# Altium schematic sheet bmsSlave_cells.SchDoc
size B; SheetNumber: 3; SheetTotal: 4
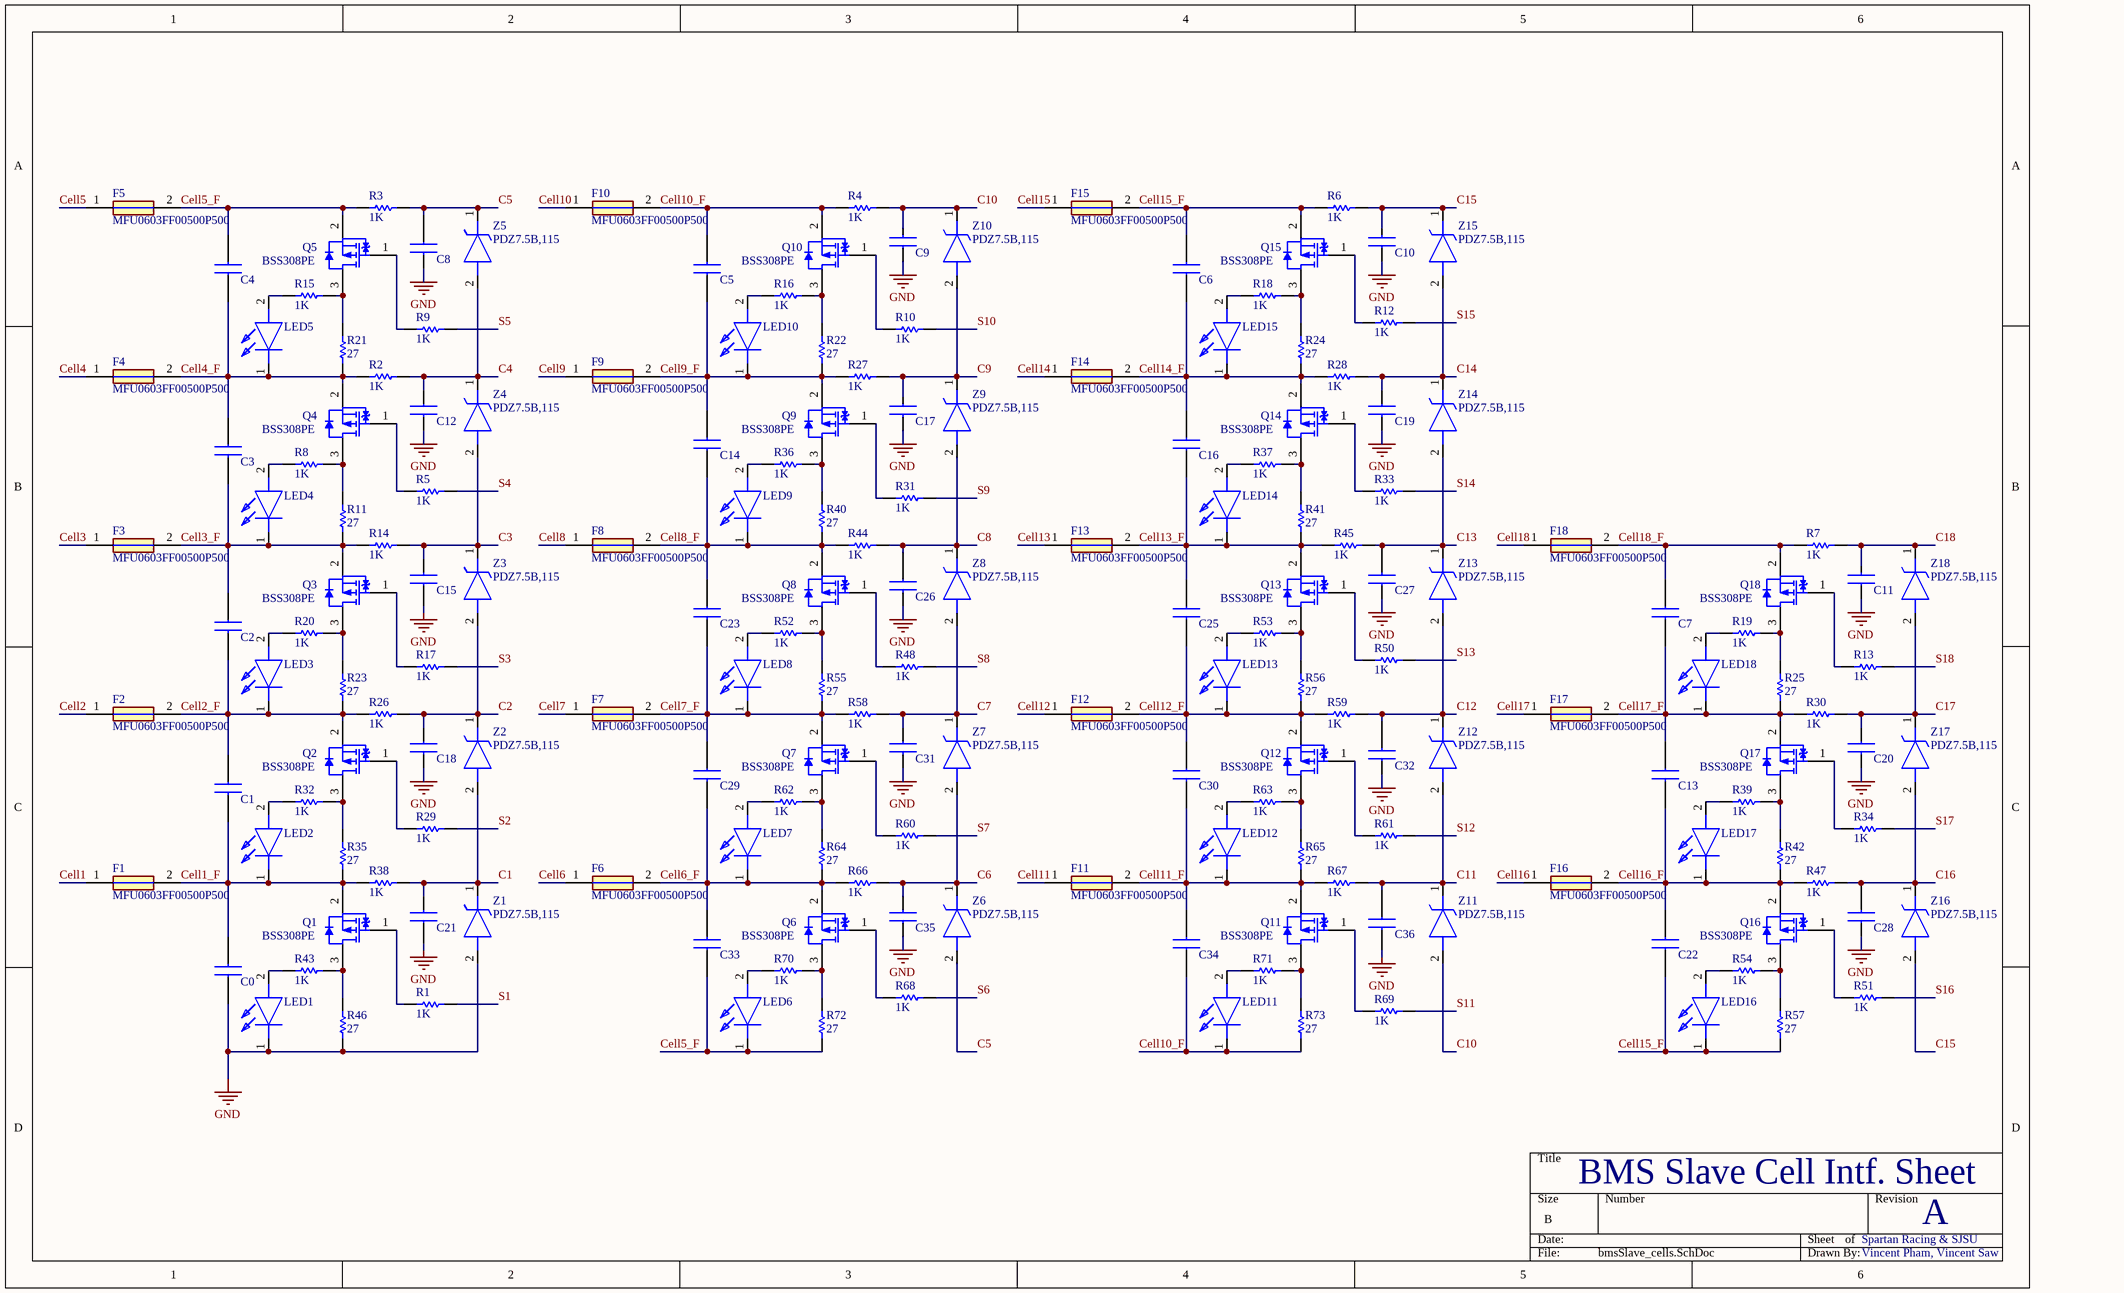
[diagram p0: bmsSlave_cells.SchDoc]

## Parts
C0  885382207009  [C0603]  (value not drawn)
C1  885382207009  [C0603]  (value not drawn)
C2  885382207009  [C0603]  (value not drawn)
C3  885382207009  [C0603]  (value not drawn)
C4  885382207009  [C0603]  (value not drawn)
C5  885382207009  [C0603]  (value not drawn)
C6  885382207009  [C0603]  (value not drawn)
C7  885382207009  [C0603]  (value not drawn)
C8  885382207009  [C0603]  (value not drawn)
C9  885382207009  [C0603]  (value not drawn)
C10  885382207009  [C0603]  (value not drawn)
C11  885382207009  [C0603]  (value not drawn)
C12  885382207009  [C0603]  (value not drawn)
C13  885382207009  [C0603]  (value not drawn)
C14  885382207009  [C0603]  (value not drawn)
C15  885382207009  [C0603]  (value not drawn)
C16  885382207009  [C0603]  (value not drawn)
C17  885382207009  [C0603]  (value not drawn)
C18  885382207009  [C0603]  (value not drawn)
C19  885382207009  [C0603]  (value not drawn)
C20  885382207009  [C0603]  (value not drawn)
C21  885382207009  [C0603]  (value not drawn)
C22  885382207009  [C0603]  (value not drawn)
C23  885382207009  [C0603]  (value not drawn)
C25  885382207009  [C0603]  (value not drawn)
C26  885382207009  [C0603]  (value not drawn)
C27  885382207009  [C0603]  (value not drawn)
C28  885382207009  [C0603]  (value not drawn)
C29  885382207009  [C0603]  (value not drawn)
C30  885382207009  [C0603]  (value not drawn)
C31  885382207009  [C0603]  (value not drawn)
C32  885382207009  [C0603]  (value not drawn)
C33  885382207009  [C0603]  (value not drawn)
C34  885382207009  [C0603]  (value not drawn)
C35  885382207009  [C0603]  (value not drawn)
C36  885382207009  [C0603]  (value not drawn)
F1  MFU0603FF00500P500  [FUSC1608X55N]
F2  MFU0603FF00500P500  [FUSC1608X55N]
F3  MFU0603FF00500P500  [FUSC1608X55N]
F4  MFU0603FF00500P500  [FUSC1608X55N]
F5  MFU0603FF00500P500  [FUSC1608X55N]
F6  MFU0603FF00500P500  [FUSC1608X55N]
F7  MFU0603FF00500P500  [FUSC1608X55N]
F8  MFU0603FF00500P500  [FUSC1608X55N]
F9  MFU0603FF00500P500  [FUSC1608X55N]
F10  MFU0603FF00500P500  [FUSC1608X55N]
F11  MFU0603FF00500P500  [FUSC1608X55N]
F12  MFU0603FF00500P500  [FUSC1608X55N]
F13  MFU0603FF00500P500  [FUSC1608X55N]
F14  MFU0603FF00500P500  [FUSC1608X55N]
F15  MFU0603FF00500P500  [FUSC1608X55N]
F16  MFU0603FF00500P500  [FUSC1608X55N]
F17  MFU0603FF00500P500  [FUSC1608X55N]
F18  MFU0603FF00500P500  [FUSC1608X55N]
LED1  LS_L29K-G1H2-1  [LEDC1308X67N]  (value not drawn)
LED2  LS_L29K-G1H2-1  [LEDC1308X67N]  (value not drawn)
LED3  LS_L29K-G1H2-1  [LEDC1308X67N]  (value not drawn)
LED4  LS_L29K-G1H2-1  [LEDC1308X67N]  (value not drawn)
LED5  LS_L29K-G1H2-1  [LEDC1308X67N]  (value not drawn)
LED6  LS_L29K-G1H2-1  [LEDC1308X67N]  (value not drawn)
LED7  LS_L29K-G1H2-1  [LEDC1308X67N]  (value not drawn)
LED8  LS_L29K-G1H2-1  [LEDC1308X67N]  (value not drawn)
LED9  LS_L29K-G1H2-1  [LEDC1308X67N]  (value not drawn)
LED10  LS_L29K-G1H2-1  [LEDC1308X67N]  (value not drawn)
LED11  LS_L29K-G1H2-1  [LEDC1308X67N]  (value not drawn)
LED12  LS_L29K-G1H2-1  [LEDC1308X67N]  (value not drawn)
LED13  LS_L29K-G1H2-1  [LEDC1308X67N]  (value not drawn)
LED14  LS_L29K-G1H2-1  [LEDC1308X67N]  (value not drawn)
LED15  LS_L29K-G1H2-1  [LEDC1308X67N]  (value not drawn)
LED16  LS_L29K-G1H2-1  [LEDC1308X67N]  (value not drawn)
LED17  LS_L29K-G1H2-1  [LEDC1308X67N]  (value not drawn)
LED18  LS_L29K-G1H2-1  [LEDC1308X67N]  (value not drawn)
Q1  BSS308PE  [INF-PG-SOT23_L]
Q2  BSS308PE  [INF-PG-SOT23_L]
Q3  BSS308PE  [INF-PG-SOT23_L]
Q4  BSS308PE  [INF-PG-SOT23_L]
Q5  BSS308PE  [INF-PG-SOT23_L]
Q6  BSS308PE  [INF-PG-SOT23_L]
Q7  BSS308PE  [INF-PG-SOT23_L]
Q8  BSS308PE  [INF-PG-SOT23_L]
Q9  BSS308PE  [INF-PG-SOT23_L]
Q10  BSS308PE  [INF-PG-SOT23_L]
Q11  BSS308PE  [INF-PG-SOT23_L]
Q12  BSS308PE  [INF-PG-SOT23_L]
Q13  BSS308PE  [INF-PG-SOT23_L]
Q14  BSS308PE  [INF-PG-SOT23_L]
Q15  BSS308PE  [INF-PG-SOT23_L]
Q16  BSS308PE  [INF-PG-SOT23_L]
Q17  BSS308PE  [INF-PG-SOT23_L]
Q18  BSS308PE  [INF-PG-SOT23_L]
R1  value 1K  [R0603]  (hidden comment: Resistor)
R2  value 1K  [R0603]  (hidden comment: Resistor)
R3  value 1K  [R0603]  (hidden comment: Resistor)
R4  value 1K  [R0603]  (hidden comment: Resistor)
R5  value 1K  [R0603]  (hidden comment: Resistor)
R6  value 1K  [R0603]  (hidden comment: Resistor)
R7  value 1K  [R0603]  (hidden comment: Resistor)
R8  value 1K  [R0603]  (hidden comment: Resistor)
R9  value 1K  [R0603]  (hidden comment: Resistor)
R10  value 1K  [R0603]  (hidden comment: Resistor)
R11  value 27  [R2512]  (hidden comment: Resistor)
R12  value 1K  [R0603]  (hidden comment: Resistor)
R13  value 1K  [R0603]  (hidden comment: Resistor)
R14  value 1K  [R0603]  (hidden comment: Resistor)
R15  value 1K  [R0603]  (hidden comment: Resistor)
R16  value 1K  [R0603]  (hidden comment: Resistor)
R17  value 1K  [R0603]  (hidden comment: Resistor)
R18  value 1K  [R0603]  (hidden comment: Resistor)
R19  value 1K  [R0603]  (hidden comment: Resistor)
R20  value 1K  [R0603]  (hidden comment: Resistor)
R21  value 27  [R2512]  (hidden comment: Resistor)
R22  value 27  [R2512]  (hidden comment: Resistor)
R23  value 27  [R2512]  (hidden comment: Resistor)
R24  value 27  [R2512]  (hidden comment: Resistor)
R25  value 27  [R2512]  (hidden comment: Resistor)
R26  value 1K  [R0603]  (hidden comment: Resistor)
R27  value 1K  [R0603]  (hidden comment: Resistor)
R28  value 1K  [R0603]  (hidden comment: Resistor)
R29  value 1K  [R0603]  (hidden comment: Resistor)
R30  value 1K  [R0603]  (hidden comment: Resistor)
R31  value 1K  [R0603]  (hidden comment: Resistor)
R32  value 1K  [R0603]  (hidden comment: Resistor)
R33  value 1K  [R0603]  (hidden comment: Resistor)
R34  value 1K  [R0603]  (hidden comment: Resistor)
R35  value 27  [R2512]  (hidden comment: Resistor)
R36  value 1K  [R0603]  (hidden comment: Resistor)
R37  value 1K  [R0603]  (hidden comment: Resistor)
R38  value 1K  [R0603]  (hidden comment: Resistor)
R39  value 1K  [R0603]  (hidden comment: Resistor)
R40  value 27  [R2512]  (hidden comment: Resistor)
R41  value 27  [R2512]  (hidden comment: Resistor)
R42  value 27  [R2512]  (hidden comment: Resistor)
R43  value 1K  [R0603]  (hidden comment: Resistor)
R44  value 1K  [R0603]  (hidden comment: Resistor)
R45  value 1K  [R0603]  (hidden comment: Resistor)
R46  value 27  [R2512]  (hidden comment: Resistor)
R47  value 1K  [R0603]  (hidden comment: Resistor)
R48  value 1K  [R0603]  (hidden comment: Resistor)
R50  value 1K  [R0603]  (hidden comment: Resistor)
R51  value 1K  [R0603]  (hidden comment: Resistor)
R52  value 1K  [R0603]  (hidden comment: Resistor)
R53  value 1K  [R0603]  (hidden comment: Resistor)
R54  value 1K  [R0603]  (hidden comment: Resistor)
R55  value 27  [R2512]  (hidden comment: Resistor)
R56  value 27  [R2512]  (hidden comment: Resistor)
R57  value 27  [R2512]  (hidden comment: Resistor)
R58  value 1K  [R0603]  (hidden comment: Resistor)
R59  value 1K  [R0603]  (hidden comment: Resistor)
R60  value 1K  [R0603]  (hidden comment: Resistor)
R61  value 1K  [R0603]  (hidden comment: Resistor)
R62  value 1K  [R0603]  (hidden comment: Resistor)
R63  value 1K  [R0603]  (hidden comment: Resistor)
R64  value 27  [R2512]  (hidden comment: Resistor)
R65  value 27  [R2512]  (hidden comment: Resistor)
R66  value 1K  [R0603]  (hidden comment: Resistor)
R67  value 1K  [R0603]  (hidden comment: Resistor)
R68  value 1K  [R0603]  (hidden comment: Resistor)
R69  value 1K  [R0603]  (hidden comment: Resistor)
R70  value 1K  [R0603]  (hidden comment: Resistor)
R71  value 1K  [R0603]  (hidden comment: Resistor)
R72  value 27  [R2512]  (hidden comment: Resistor)
R73  value 27  [R2512]  (hidden comment: Resistor)
Z1  PDZ7.5B,115  [SOD2512X110N]
Z2  PDZ7.5B,115  [SOD2512X110N]
Z3  PDZ7.5B,115  [SOD2512X110N]
Z4  PDZ7.5B,115  [SOD2512X110N]
Z5  PDZ7.5B,115  [SOD2512X110N]
Z6  PDZ7.5B,115  [SOD2512X110N]
Z7  PDZ7.5B,115  [SOD2512X110N]
Z8  PDZ7.5B,115  [SOD2512X110N]
Z9  PDZ7.5B,115  [SOD2512X110N]
Z10  PDZ7.5B,115  [SOD2512X110N]
Z11  PDZ7.5B,115  [SOD2512X110N]
Z12  PDZ7.5B,115  [SOD2512X110N]
Z13  PDZ7.5B,115  [SOD2512X110N]
Z14  PDZ7.5B,115  [SOD2512X110N]
Z15  PDZ7.5B,115  [SOD2512X110N]
Z16  PDZ7.5B,115  [SOD2512X110N]
Z17  PDZ7.5B,115  [SOD2512X110N]
Z18  PDZ7.5B,115  [SOD2512X110N]

## Nets
GND: C0.1 C8.1 C9.1 C10.1 C11.1 C12.1 C15.1 C17.1 C18.1 C19.1 C20.1 C21.1 C26.1 C27.1 C28.1 C31.1 C32.1 C35.1 C36.1 LED1.1(K) R46.2 Z1.2(A)
C1: C21.2 R38.1 Z1.1(K) Z2.2(A)
C2: C18.2 R26.1 Z2.1(K) Z3.2(A)
C3: C15.2 R14.1 Z3.1(K) Z4.2(A)
C4: C12.2 R2.1 Z4.1(K) Z5.2(A)
C5: C8.2 R3.1 Z5.1(K) Z6.2(A)
C6: C35.2 R66.1 Z6.1(K) Z7.2(A)
C7: C31.2 R58.1 Z7.1(K) Z8.2(A)
C8: C26.2 R44.1 Z8.1(K) Z9.2(A)
C9: C17.2 R27.1 Z9.1(K) Z10.2(A)
C10: C9.2 R4.1 Z10.1(K) Z11.2(A)
C11: C36.2 R67.1 Z11.1(K) Z12.2(A)
C12: C32.2 R59.1 Z12.1(K) Z13.2(A)
C13: C27.2 R45.1 Z13.1(K) Z14.2(A)
C14: C19.2 R28.1 Z14.1(K) Z15.2(A)
C15: C10.2 R6.1 Z15.1(K) Z16.2(A)
C16: C28.2 R47.1 Z16.1(K) Z17.2(A)
C17: C20.2 R30.1 Z17.1(K) Z18.2(A)
C18: C11.2 R7.1 Z18.1(K)
Cell1: F1.1
Cell1_F: C0.2 C1.1 F1.2 LED2.1(K) Q1.2(SOURCE) R35.2 R38.2
Cell2: F2.1
Cell2_F: C1.2 C2.1 F2.2 LED3.1(K) Q2.2(SOURCE) R23.2 R26.2
Cell3: F3.1
Cell3_F: C2.2 C3.1 F3.2 LED4.1(K) Q3.2(SOURCE) R11.2 R14.2
Cell4: F4.1
Cell4_F: C3.2 C4.1 F4.2 LED5.1(K) Q4.2(SOURCE) R2.2 R21.2
Cell5: F5.1
Cell5_F: C4.2 C33.1 F5.2 LED6.1(K) Q5.2(SOURCE) R3.2 R72.2
Cell6: F6.1
Cell6_F: C29.1 C33.2 F6.2 LED7.1(K) Q6.2(SOURCE) R64.2 R66.2
Cell7: F7.1
Cell7_F: C23.1 C29.2 F7.2 LED8.1(K) Q7.2(SOURCE) R55.2 R58.2
Cell8: F8.1
Cell8_F: C14.1 C23.2 F8.2 LED9.1(K) Q8.2(SOURCE) R40.2 R44.2
Cell9: F9.1
Cell9_F: C5.1 C14.2 F9.2 LED10.1(K) Q9.2(SOURCE) R22.2 R27.2
Cell10: F10.1
Cell10_F: C5.2 C34.1 F10.2 LED11.1(K) Q10.2(SOURCE) R4.2 R73.2
Cell11: F11.1
Cell11_F: C30.1 C34.2 F11.2 LED12.1(K) Q11.2(SOURCE) R65.2 R67.2
Cell12: F12.1
Cell12_F: C25.1 C30.2 F12.2 LED13.1(K) Q12.2(SOURCE) R56.2 R59.2
Cell13: F13.1
Cell13_F: C16.1 C25.2 F13.2 LED14.1(K) Q13.2(SOURCE) R41.2 R45.2
Cell14: F14.1
Cell14_F: C6.1 C16.2 F14.2 LED15.1(K) Q14.2(SOURCE) R24.2 R28.2
Cell15: F15.1
Cell15_F: C6.2 C22.1 F15.2 LED16.1(K) Q15.2(SOURCE) R6.2 R57.2
Cell16: F16.1
Cell16_F: C13.1 C22.2 F16.2 LED17.1(K) Q16.2(SOURCE) R42.2 R47.2
Cell17: F17.1
Cell17_F: C7.1 C13.2 F17.2 LED18.1(K) Q17.2(SOURCE) R25.2 R30.2
Cell18: F18.1
Cell18_F: C7.2 F18.2 Q18.2(SOURCE) R7.2
S1: R1.1
S2: R29.1
S3: R17.1
S4: R5.1
S5: R9.1
S6: R68.1
S7: R60.1
S8: R48.1
S9: R31.1
S10: R10.1
S11: R69.1
S12: R61.1
S13: R50.1
S14: R33.1
S15: R12.1
S16: R51.1
S17: R34.1
S18: R13.1
NetLED1_2: LED1.2(A) R43.2
NetLED2_2: LED2.2(A) R32.2
NetLED3_2: LED3.2(A) R20.2
NetLED4_2: LED4.2(A) R8.2
NetLED5_2: LED5.2(A) R15.2
NetLED6_2: LED6.2(A) R70.2
NetLED7_2: LED7.2(A) R62.2
NetLED8_2: LED8.2(A) R52.2
NetLED9_2: LED9.2(A) R36.2
NetLED10_2: LED10.2(A) R16.2
NetLED11_2: LED11.2(A) R71.2
NetLED12_2: LED12.2(A) R63.2
NetLED13_2: LED13.2(A) R53.2
NetLED14_2: LED14.2(A) R37.2
NetLED15_2: LED15.2(A) R18.2
NetLED16_2: LED16.2(A) R54.2
NetLED17_2: LED17.2(A) R39.2
NetLED18_2: LED18.2(A) R19.2
NetQ1_1: Q1.1(GATE) R1.2
NetQ1_3: Q1.3(DRAIN) R43.1 R46.1
NetQ2_1: Q2.1(GATE) R29.2
NetQ2_3: Q2.3(DRAIN) R32.1 R35.1
NetQ3_1: Q3.1(GATE) R17.2
NetQ3_3: Q3.3(DRAIN) R20.1 R23.1
NetQ4_1: Q4.1(GATE) R5.2
NetQ4_3: Q4.3(DRAIN) R8.1 R11.1
NetQ5_1: Q5.1(GATE) R9.2
NetQ5_3: Q5.3(DRAIN) R15.1 R21.1
NetQ6_1: Q6.1(GATE) R68.2
NetQ6_3: Q6.3(DRAIN) R70.1 R72.1
NetQ7_1: Q7.1(GATE) R60.2
NetQ7_3: Q7.3(DRAIN) R62.1 R64.1
NetQ8_1: Q8.1(GATE) R48.2
NetQ8_3: Q8.3(DRAIN) R52.1 R55.1
NetQ9_1: Q9.1(GATE) R31.2
NetQ9_3: Q9.3(DRAIN) R36.1 R40.1
NetQ10_1: Q10.1(GATE) R10.2
NetQ10_3: Q10.3(DRAIN) R16.1 R22.1
NetQ11_1: Q11.1(GATE) R69.2
NetQ11_3: Q11.3(DRAIN) R71.1 R73.1
NetQ12_1: Q12.1(GATE) R61.2
NetQ12_3: Q12.3(DRAIN) R63.1 R65.1
NetQ13_1: Q13.1(GATE) R50.2
NetQ13_3: Q13.3(DRAIN) R53.1 R56.1
NetQ14_1: Q14.1(GATE) R33.2
NetQ14_3: Q14.3(DRAIN) R37.1 R41.1
NetQ15_1: Q15.1(GATE) R12.2
NetQ15_3: Q15.3(DRAIN) R18.1 R24.1
NetQ16_1: Q16.1(GATE) R51.2
NetQ16_3: Q16.3(DRAIN) R54.1 R57.1
NetQ17_1: Q17.1(GATE) R34.2
NetQ17_3: Q17.3(DRAIN) R39.1 R42.1
NetQ18_1: Q18.1(GATE) R13.2
NetQ18_3: Q18.3(DRAIN) R19.1 R25.1

## Notes on the sheet
- BMS Slave Cell Intf. Sheet
- Spartan Racing & SJSU
- A
- Vincent Pham, Vincent Saw

## Library data of the parts
C0-C23 C25-C36 = 885382207009: Multilayer Ceramic Chip Capacitor WCAP-CSST Series 0805 10000pF X7R0805103K100DFCT1S000; Manufacturer_Name: Wurth Elektronik; Geometry.Height: 1.35mm; Mouser Part Number: 710-885382207009; Mouser Price/Stock: https://www.mouser.co.uk/ProductDetail/Wurth-Elektronik/885382207009?qs=0lSvoLzn4L%2FLliJ98PmFYg%3D%3D; Manufacturer_Part_Number: 885382207009; Datasheet Link: https://katalog.we-online.com/pbs/datasheet/885382207009.pdf
F1-F18 = MFU0603FF00500P500: Fuse; Manufacturer_Name: Vishay; Datasheet Link: https://componentsearchengine.com/Datasheets/1/MFU0603FF00500P500.pdf; Height: 0.55mm; Manufacturer_Part_Number: MFU0603FF00500P500; Mouser Part Number: 594-MFU0603-FF-0.5; Mouser Price/Stock: https://www.mouser.co.uk/ProductDetail/Vishay-Beyschlag/MFU0603FF00500P500?qs=Ok6sVjDQtqZISHXP1RFN1Q%3D%3D
LED1-LED18 = LS_L29K-G1H2-1: LED; Manufacturer_Name: OSRAM; Manufacturer_Part_Number: LS L29K-G1H2-1; Datasheet Link: https://dammedia.osram.info/media/resource/hires/osram-dam-5662679/LS%20L29K_EN.pdf; Height: 0.67mm; Mouser Part Number: 720-LSL29K-G1H2-1-Z; Mouser Price/Stock: https://www.mouser.com/Search/Refine.aspx?Keyword=720-LSL29K-G1H2-1-Z; Arrow Part Number: LS L29K-G1H2-1; Arrow Price/Stock: https://www.arrow.com/en/products/ls-l29k-g1h2-1/osram-opto-semiconductors
Q1-Q18 = CMP-1099-00030-1: P-Channel OptiMOS P3 Small-Signal-Transistor, -30 V VDS, -2 A ID, -55 to 150 degC, PG-SOT23, Reel, Green; Manufacturer: Infineon; RDS (on) (max) (@4.5V): 130Â mOhm; Pto t (max): 0.5Â W; ID (max): -2Â A; IDpuls (max): -8Â A; VDS (max): -30Â V; VGS(th) (min): -2Â V; Green: TRUE; RDS (on) (max): 80Â mOhm; QG: -5Â nC; Rth: 250Â K/W; VGS(th) (max): -1Â V; PartNumber: BSS308PE; ComponentLink3Description: Package Specification; PackageDescription: 3-Pin Small Outline Transistor Package, 2.9 x 1.3 mm Body, 0.95 mm Pitch; Mounting Technology: Surface Mount; Packing: Reel; PackageReference: PG-SOT23; PackageVersion: Apr-08; Halogen-free: TRUE; DatasheetVersion: Rev. 2.03; ComponentLink2URL: http://www.infineon.com/dgdl/BSS308PE_Rev23_.pdf?folderId=db3a304314dca38901154a72e3951a65&fileId=db3a304330f686060131099c80400073; ComponentLink2Description: Datasheet; ComponentLink1Description: Manufacturer URL; ComponentLink1URL: http://www.infineon.com/; ComponentLink3URL: http://www.infineon.com/dgdl/SOT23-Package_Overview.pdf?folderId=db3a30431936bc4b0119532290053c66&fileId=db3a30431936bc4b0119533468123c85
R1-R48 R50-R73 = Resistor: TC1: 0; SimulationGenericComponent: True; TC2: 0
  R9: Supplier: Future Electronics; Supplier Part Number: 1029290
Z1-Z18 = PDZ7.5B,115: Zener Diode; Manufacturer_Name: Nexperia; Datasheet Link: https://assets.nexperia.com/documents/data-sheet/PDZ-B_SER.pdf; Height: 1.1mm; Manufacturer_Part_Number: PDZ7.5B,115; Mouser Part Number: 771-PDZ75B115; Mouser Price/Stock: https://www.mouser.co.uk/ProductDetail/Nexperia/PDZ75B115?qs=LOCUfHb8d9tcy1Hn7wNhcw%3D%3D; Arrow Part Number: PDZ7.5B,115; Arrow Price/Stock: https://www.arrow.com/en/products/pdz7.5b115/nexperia